# Altium schematic sheet 4_Battery_Heater_Controller.SchDoc: Batteries Heater Controller
size A4; DrawnBy: Sara V. Martínez; Engineer: Flight; DocumentNumber: 7; Revision: V0.1; SheetNumber: 7; SheetTotal: 11
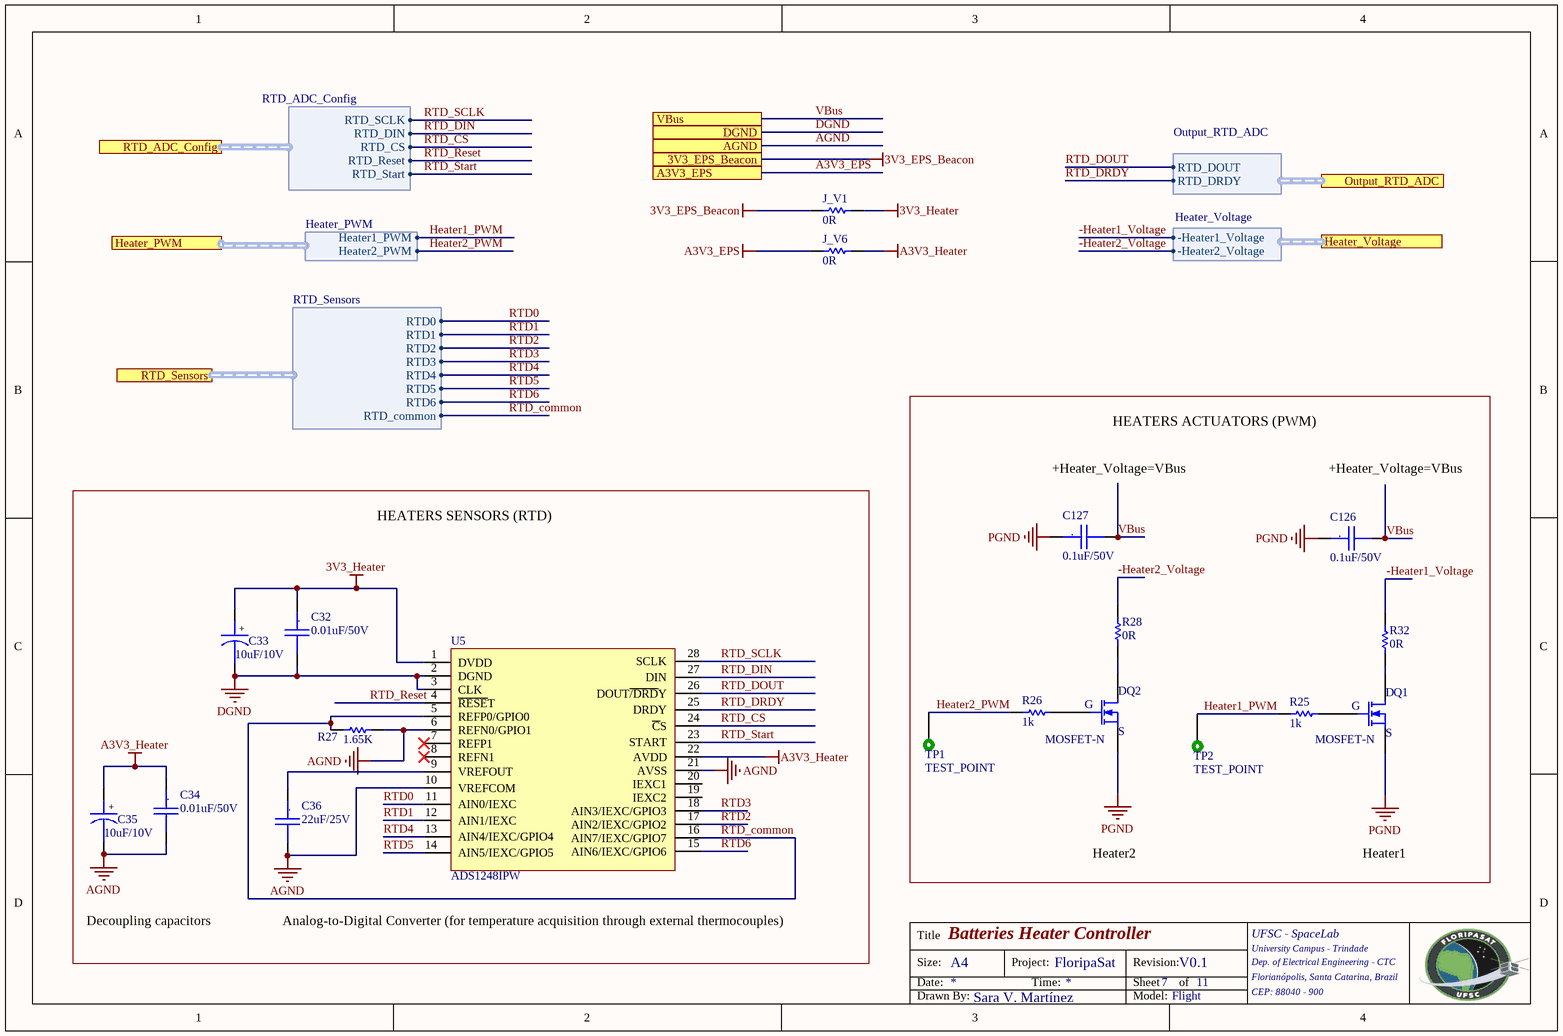
[diagram p0: 4_Battery_Heater_Controller.SchDoc]

## Parts
C32  0.01uF/50V  [CC0805]
C33  10uF/10V  [CC0805_Tantalum]
C34  0.01uF/50V  [CC0805]
C35  10uF/10V  [CC0805_Tantalum]
C36  22uF/25V  [CC1210]
C126  0.1uF/50V  [CC0805]
C127  0.1uF/50V  [CC0805]
J_V1  0R  [0805]
J_V6  0R  [0805]
Q1  MOSFET-N  [SOIC8_Mosfet]
Q2  MOSFET-N  [SOIC8_Mosfet]
R25  1k  [0805]
R26  1k  [0805]
R27  1.65K  [0805]
R28  0R  [0805]
R32  0R  [0805]
TP1  TEST_POINT  [TEST_POINT]  (no BOM)
TP2  TEST_POINT  [TEST_POINT]  (no BOM)
U5  ADS1248IPW  [TSSOP28]

## Blocks framed on the sheet
HEATERS ACTUATORS (PWM): C126 C127 Q1 Q2 R25 R26 R28 R32 TP1 TP2
HEATERS SENSORS (RTD): C32-C36 R27 U5

## Ports
3V3_EPS_Beacon, A3V3_EPS, AGND, DGND, Heater_PWM (harness Heater_PWM), Heater_Voltage (harness Heater_Voltage), Output_RTD_ADC (harness Output_RTD_ADC), RTD_ADC_Config (harness RTD_ADC_Config), RTD_Sensors (harness RTD_Sensors), VBus

## Harnesses
Output_RTD_ADC: RTD_DOUT, RTD_DRDY
RTD_ADC_Config: RTD_SCLK, RTD_DIN, RTD_CS, RTD_Reset, RTD_Start
RTD_Sensors: RTD1, RTD2, RTD3, RTD4, RTD5, RTD6, RTD0, RTD_common
Heater_PWM: Heater1_PWM, Heater2_PWM
Heater_Voltage: -Heater1_Voltage, -Heater2_Voltage

## Nets
3V3_EPS_Beacon: J_V1.2 ; port 3V3_EPS_Beacon
3V3_Heater: C32.1 C33.1 J_V1.1 U5.1(DVDD)
A3V3_EPS: J_V6.2 ; port A3V3_EPS
A3V3_Heater: C34.1 C35.1 J_V6.1 U5.22(AVDD)
AGND: C34.2 C35.2 C36.2 R27.1 U5.6(REFN0/GPIO1) U5.10(VREFCOM) U5.21(AVSS) ; port AGND
DGND: C32.2 C33.2 U5.2(DGND) U5.3(CLK) ; port DGND
PGND: C126.1 C127.1 Q1.1(S) Q2.1(S)
-Heater1_Voltage: R32.1 ; port Heater_Voltage.-Heater1_Voltage
-Heater2_Voltage: R28.1 ; port Heater_Voltage.-Heater2_Voltage
Heater1_PWM: R25.2 TP2.1 ; port Heater_PWM.Heater1_PWM
Heater2_PWM: R26.2 TP1.1 ; port Heater_PWM.Heater2_PWM
RTD0: U5.11(AIN0/IEXC) ; port RTD_Sensors.RTD0
RTD1: U5.12(AIN1/IEXC) ; port RTD_Sensors.RTD1
RTD2: U5.17(AIN2/IEXC/GPIO2) ; port RTD_Sensors.RTD2
RTD3: U5.18(AIN3/IEXC/GPIO3) ; port RTD_Sensors.RTD3
RTD4: U5.13(AIN4/IEXC/GPIO4) ; port RTD_Sensors.RTD4
RTD5: U5.14(AIN5/IEXC/GPIO5) ; port RTD_Sensors.RTD5
RTD6: U5.15(AIN6/IEXC/GPIO6) ; port RTD_Sensors.RTD6
RTD_common: R27.2 U5.5(REFP0/GPIO0) U5.16(AIN7/IEXC/GPIO7) ; port RTD_Sensors.RTD_common
RTD_CS: U5.24(~{C}S) ; port RTD_ADC_Config.RTD_CS
RTD_DIN: U5.27(DIN) ; port RTD_ADC_Config.RTD_DIN
RTD_DOUT: U5.26(DOUT~{/DRD}Y) ; port Output_RTD_ADC.RTD_DOUT
RTD_DRDY: U5.25(DRDY) ; port Output_RTD_ADC.RTD_DRDY
RTD_Reset: U5.4(~{RESE}T) ; port RTD_ADC_Config.RTD_Reset
RTD_SCLK: U5.28(SCLK) ; port RTD_ADC_Config.RTD_SCLK
RTD_Start: U5.23(START) ; port RTD_ADC_Config.RTD_Start
VBus: C126.2 C127.2 ; port VBus
NetC36_1: C36.1 U5.9(VREFOUT)
NetQ1_2: Q1.2(G) R25.1
NetQ1_3: Q1.3(D) R32.2
NetQ2_2: Q2.2(G) R26.1
NetQ2_3: Q2.3(D) R28.2

Not connected (* = marked no-connect by the designer): U5 7(REFP1)* 8(REFN1)* 19(IEXC2) 20(IEXC1)

## Notes on the sheet
- +Heater_Voltage=VBus
- Decoupling capacitors
- Analog-to-Digital Converter (for temperature acquisition through external thermocouples)
- Heater2
- Heater1
- Title
- Size:
- Date:
- A4
- Project:
- Time:
- FloripaSat
- Revision:
- Sheet
- of
- UFSC - SpaceLab
- University Campus - Trindade
- Dep. of Electrical Engineering - CTC
- Florianópolis, Santa Catarina, Brazil
- Drawn By:
- Model:
- CEP: 88040 - 900
- (in symbol Cap_Cer_X7R_0.01uF_16V_1210) .
- (in symbol Cap_Cer_X7R_0.1uF_25V_0805) .
- (in symbol Cap_Cer_X7R_0.01uF_50V_0805) .
- (in symbol Cap_Tant_SMD_10uF_6V3_0805) +

## Library data of the parts
C32 C34 = Cap_Cer_X7R_0.01uF_50V_0805: CAP CER 0.01uF 50V 10% X7R 0805; Partnumber: GRM216R71H103KA01D; NCM: 8532.24.10
C33 C35 = Cap_Tant_SMD_10uF_6V3_0805: CAP Tantalum 10uF 6.3V 10% 0805; Partnumber: TPSR106K006R1000; NCM: 8532.21.11
C36 = Cap_Cer_X7R_0.01uF_16V_1210: CAP CER 22uF 25V 10% X7R 1210; Partnumber: GRM31CR71A226KE15L; NCM: 8532.24.10
C126 C127 = Cap_Cer_X7R_0.1uF_25V_0805: CAP CER 0.1UF 50V 10% X7R 0805; Partnumber: GRM216R71H103KA01D; NCM: 8532.24.10
J_V1 J_V6 R28 R32 = R0R_JUMPER_1/16W_0805: RES 0R OHM 1/16W JUMPER 0805; Partnumber: CRCW08050000Z0EA; NCM: 8533.21.20
Q1 Q2 = MOSFET-N_30V_Si4010DY: MOSFET N-Channel 30V; Partnumber: SI4010DY-T1-GE3; Published: 8-Jun-2000; LatestRevisionDate: 17-Jul-2002; LatestRevisionNote: Re-released for DXP Platform.; PackageVersion: 1995/1996; PackageReference: E3; Publisher: Altium Limited; PackageDescription: TO, Flat Index; 3 In-Line, Axial Leads; Body Dia. 4.6mm; Lead Dia. 0.5 mm (max)
R25 R26 = R1.0k_1%_1/8W_0805: RES 1.0K OHM 1/8W 1% 0805; Partnumber: ERJ-6ENF1001V; NCM: 8533.21.20
R27 = R1.65K_1%_1/10W_0805: RES 1.65K OHM 1/10W 0.1% 0805; Partnumber: PCF0805R-1K65BT1; NCM: 8533.21.20
TP1 TP2 = TEST_POINT: Test point
U5 = ADS1248IPW: 24 bit ADC Differential Input, SPI, 28-pin TSSOP; Manufacturer: Texas Instruments; Part_Number: ADS1248IPWR; Number of Bits: 24; Sampling Rate (Per Second): 2k; Number of Inputs: 4, 7; Input Type: Differential, Single Ended; Configuration: MUX-PGA-ADC; Number of A/D Converters: 1; Architecture: Sigma-Delta; Reference Type: External, Internal; Voltage - Supply, Analog: 2.7 V ~ 5.25 V; Datasheet: *; Supplier: RS Online; Supplier_Link: http://uk.rs-online.com/web/p/general-purpose-adcs/7091921/?searchTerm=ads1248&relevancy-data=636F3D3226696E3D4931384E4B6E6F776E41734D504E266C753D656E266D6D3D6D61746368616C6C7061727469616C26706D3D5E5B5C707B4C7D5C707B4E647D2D2C2F255C2E5D2B2426706F3D313326736E3D592673743D4D414E5F504152545F4E554D4245522677633D424F5448267573743D6164733132343826; Supplier_Part_Number: 709-1921; Price: £7.51; Supplier 1: Digi-Key; Manufacturer Part Number: ADS1248IPW; RoHS: RoHS Compliant; Category: Integrated Circuits (ICs); Stock 1: 1835; Pricing 1: 1=10.49, 10=9.535, 25=8.822, 50=8.3402, 100=8.0994, 250=7.38576, 500=6.91298, 750=6.58295, 1000=5.96079 (EUR); Packaging: Tube; Data Interface: SPI; Ratio - S/H:ADC: -; Voltage - Supply, Digital: 2.7 V ~ 5.25 V; Features: PGA, Temperature Sensor; Operating Temperature: -40°C ~ 105°C; Package / Case: 28-TSSOP (0.173", 4.40mm Width); Supplier Device Package: 28-TSSOP; ComponentLink1URL: http://www.ti.com/lit/ds/symlink/ads1246.pdf; ComponentLink1Description: http://www.ti.com/lit/ds/symlink/ads1246.pdf; Supplier 2: Farnell; Supplier 3: Newark; Supplier Part Number 1: 296-24294-5-ND; Supplier Part Number 2: 1735557; Supplier Part Number 3: 05R0320; partnumber: ADS1248IPWR